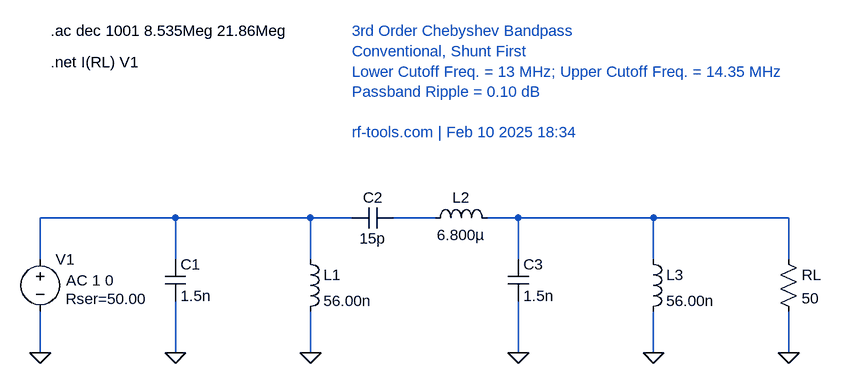
[diagram p0: schematic filter (1).asc]
filter (1).asc, the LTspice schematic file:
Version 4
SHEET 1 1204 400
WIRE 208 0 0 0
WIRE 416 0 208 0
WIRE 480 0 416 0
WIRE 608 0 544 0
WIRE 736 0 688 0
WIRE 944 0 736 0
WIRE 1152 0 944 0
WIRE 0 64 0 0
WIRE 208 64 208 0
WIRE 416 64 416 0
WIRE 736 64 736 0
WIRE 944 64 944 0
WIRE 1152 64 1152 0
WIRE 0 208 0 144
WIRE 208 208 208 128
WIRE 416 208 416 144
WIRE 736 208 736 128
WIRE 944 208 944 144
WIRE 1152 208 1152 144
FLAG 0 208 0
FLAG 208 208 0
FLAG 416 208 0
FLAG 736 208 0
FLAG 944 208 0
FLAG 1152 208 0
SYMBOL voltage 0 48 R0
WINDOW 123 40 48 Left 2
WINDOW 39 39 77 Left 2
SYMATTR Value2 AC 1 0
SYMATTR SpiceLine Rser=50.00
SYMATTR InstName V1
SYMATTR Value ""
SYMBOL cap 192 64 R0
SYMATTR InstName C1
SYMATTR Value 1.5n
SYMBOL ind 400 48 R0
SYMATTR InstName L1
SYMATTR Value 56.00n
SYMBOL cap 480 16 R270
WINDOW 0 32 32 VTop 2
WINDOW 3 0 32 VBottom 2
SYMATTR InstName C2
SYMATTR Value 15p
SYMBOL ind 592 16 R270
WINDOW 0 32 56 VTop 2
WINDOW 3 5 56 VBottom 2
SYMATTR InstName L2
SYMATTR Value 6.800µ
SYMBOL cap 720 64 R0
SYMATTR InstName C3
SYMATTR Value 1.5n
SYMBOL ind 928 48 R0
SYMATTR InstName L3
SYMATTR Value 56.00n
SYMBOL res 1136 48 R0
SYMATTR InstName RL
SYMATTR Value 50
TEXT 16 -288 Left 2 !.ac dec 1001 8.535Meg 21.86Meg
TEXT 16 -240 Left 2 !.net I(RL) V1
TEXT 480 -288 Left 2 ;3rd Order Chebyshev Bandpass\nConventional, Shunt First\nLower Cutoff Freq. = 13 MHz; Upper Cutoff Freq. = 14.35 MHz\nPassband Ripple = 0.10 dB\n\nrf-tools.com | Feb 10 2025 18:34

The netlist it stands for:
* filter (1).asc
V1 N001 0 AC 1 0 Rser=50.00
C1 N001 0 1.5n
L1 N001 0 56.00n
C2 N001 N002 15p
L2 N002 N003 6.800µ
C3 N003 0 1.5n
L3 N003 0 56.00n
RL N003 0 50
.ac dec 1001 8.535Meg 21.86Meg
.net I(RL) V1
* 3rd Order Chebyshev Bandpass
* Conventional, Shunt First
* Lower Cutoff Freq. = 13 MHz; Upper Cutoff Freq. = 14.35 MHz
* Passband Ripple = 0.10 dB
* rf-tools.com | Feb 10 2025 18:34
.backanno
.end